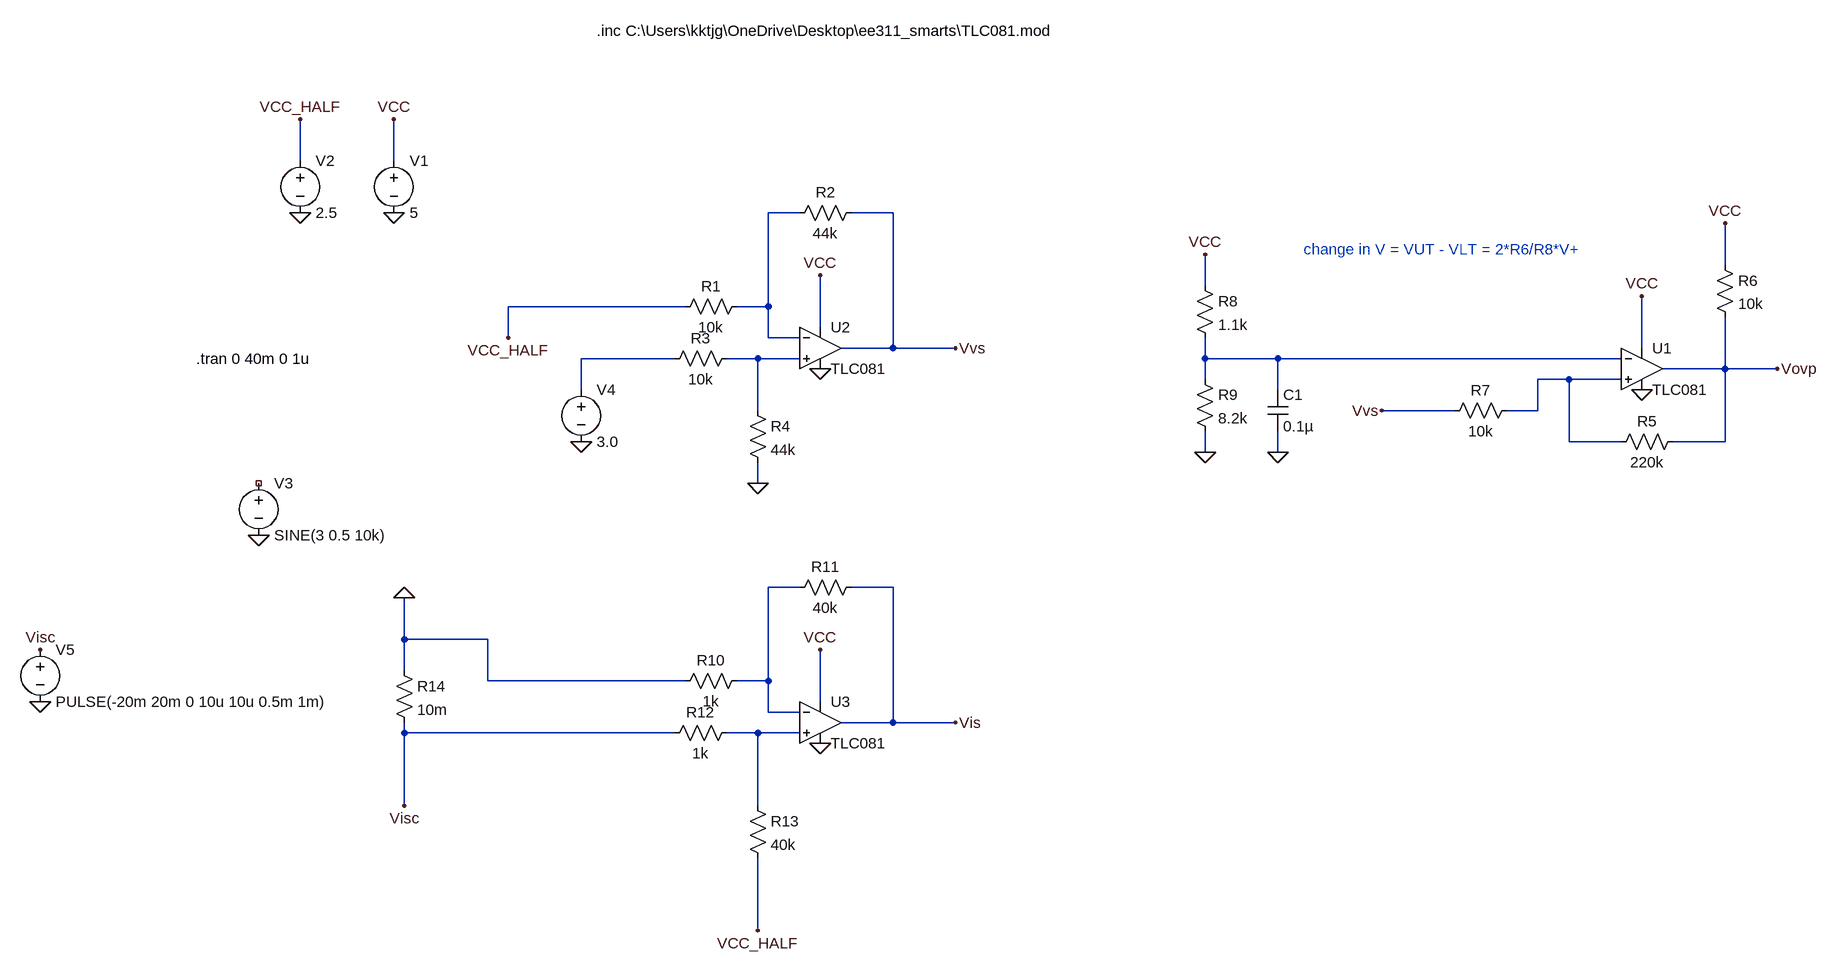
[diagram p0: schematic voltagesensing.asc]
voltagesensing.asc, the LTspice schematic file:
Version 4.1
SHEET 1 4088 1428
WIRE -736 -224 -736 -288
WIRE -592 -224 -592 -288
WIRE 32 -144 -16 -144
WIRE 176 -144 112 -144
WIRE 1456 -64 1456 -128
WIRE 656 -32 656 -80
WIRE -144 0 -416 0
WIRE -16 0 -16 -144
WIRE -16 0 -64 0
WIRE 64 32 64 -48
WIRE -416 48 -416 0
WIRE -16 48 -16 0
WIRE 32 48 -16 48
WIRE 176 64 176 -144
WIRE 176 64 96 64
WIRE 272 64 176 64
WIRE 1328 64 1328 -16
WIRE -160 80 -304 80
WIRE -32 80 -80 80
WIRE 32 80 -32 80
WIRE 656 80 656 48
WIRE 768 80 656 80
WIRE 1296 80 768 80
WIRE 1456 96 1456 16
WIRE 1456 96 1360 96
WIRE 1536 96 1456 96
WIRE 656 112 656 80
WIRE 1216 112 1168 112
WIRE 1296 112 1216 112
WIRE -304 128 -304 80
WIRE 768 128 768 80
WIRE -32 160 -32 80
WIRE 1040 160 928 160
WIRE 1168 160 1168 112
WIRE 1168 160 1120 160
WIRE 1216 208 1216 112
WIRE 1296 208 1216 208
WIRE 1456 208 1456 96
WIRE 1456 208 1376 208
WIRE 656 224 656 192
WIRE 768 224 768 192
WIRE -32 272 -32 240
WIRE 32 432 -16 432
WIRE 176 432 112 432
WIRE -576 512 -576 448
WIRE -448 512 -576 512
WIRE -576 560 -576 512
WIRE -448 576 -448 512
WIRE -144 576 -448 576
WIRE -16 576 -16 432
WIRE -16 576 -64 576
WIRE 64 608 64 528
WIRE -16 624 -16 576
WIRE 32 624 -16 624
WIRE 176 640 176 432
WIRE 176 640 96 640
WIRE 272 640 176 640
WIRE -576 656 -576 640
WIRE -160 656 -576 656
WIRE -32 656 -80 656
WIRE 32 656 -32 656
WIRE -576 768 -576 656
WIRE -32 768 -32 656
WIRE -32 960 -32 848
FLAG -592 -144 0
FLAG 64 -48 VCC
FLAG -736 -144 0
FLAG -592 -288 VCC
FLAG -736 -288 VCC_HALF
FLAG -304 208 0
FLAG -416 48 VCC_HALF
FLAG 64 96 0
FLAG -32 272 0
FLAG 1536 96 Vovp
FLAG 1328 -16 VCC
FLAG 1456 -128 VCC
FLAG 272 64 Vvs
FLAG 928 160 Vvs
FLAG 656 224 0
FLAG 656 -80 VCC
FLAG 768 224 0
FLAG 1328 128 0
FLAG -800 352 0
FLAG 64 528 VCC
FLAG 64 672 0
FLAG 272 640 Vis
FLAG -32 960 VCC_HALF
FLAG -1136 608 0
FLAG -1136 528 Visc
FLAG -576 448 0
FLAG -576 768 Visc
SYMBOL voltage -592 -240 R0
WINDOW 123 0 0 Left 0
WINDOW 39 0 0 Left 0
SYMATTR InstName V1
SYMATTR Value 5
SYMBOL voltage -736 -240 R0
WINDOW 123 0 0 Left 0
WINDOW 39 0 0 Left 0
SYMATTR InstName V2
SYMATTR Value 2.5
SYMBOL res -48 -16 R90
WINDOW 0 0 56 VBottom 2
WINDOW 3 32 56 VTop 2
SYMATTR InstName R1
SYMATTR Value 10k
SYMBOL res 128 -160 R90
WINDOW 0 0 56 VBottom 2
WINDOW 3 32 56 VTop 2
SYMATTR InstName R2
SYMATTR Value 44k
SYMBOL OpAmps\\opamp2 64 0 R0
SYMATTR InstName U2
SYMATTR Value TLC081
SYMBOL res -64 64 R90
WINDOW 0 0 56 VBottom 2
WINDOW 3 32 56 VTop 2
SYMATTR InstName R3
SYMATTR Value 10k
SYMBOL res -48 144 R0
SYMATTR InstName R4
SYMATTR Value 44k
SYMBOL res 1392 192 R90
WINDOW 0 0 56 VBottom 2
WINDOW 3 32 56 VTop 2
SYMATTR InstName R5
SYMATTR Value 220k
SYMBOL res 1440 -80 R0
SYMATTR InstName R6
SYMATTR Value 10k
SYMBOL res 1136 144 R90
WINDOW 0 0 56 VBottom 2
WINDOW 3 32 56 VTop 2
SYMATTR InstName R7
SYMATTR Value 10k
SYMBOL res 640 -48 R0
SYMATTR InstName R8
SYMATTR Value 1.1k
SYMBOL res 640 96 R0
SYMATTR InstName R9
SYMATTR Value 8.2k
SYMBOL cap 752 128 R0
SYMATTR InstName C1
SYMATTR Value 0.1µ
SYMBOL OpAmps\\opamp2 1328 32 R0
SYMATTR InstName U1
SYMATTR Value TLC081
SYMBOL voltage -800 256 R0
WINDOW 123 0 0 Left 0
WINDOW 39 0 0 Left 0
SYMATTR InstName V3
SYMATTR Value SINE(3 0.5 10k)
SYMBOL voltage -304 112 R0
WINDOW 123 0 0 Left 0
WINDOW 39 0 0 Left 0
SYMATTR InstName V4
SYMATTR Value 3.0
SYMBOL res -48 560 R90
WINDOW 0 0 56 VBottom 2
WINDOW 3 32 56 VTop 2
SYMATTR InstName R10
SYMATTR Value 1k
SYMBOL res 128 416 R90
WINDOW 0 0 56 VBottom 2
WINDOW 3 32 56 VTop 2
SYMATTR InstName R11
SYMATTR Value 40k
SYMBOL OpAmps\\opamp2 64 576 R0
SYMATTR InstName U3
SYMATTR Value TLC081
SYMBOL res -64 640 R90
WINDOW 0 0 56 VBottom 2
WINDOW 3 32 56 VTop 2
SYMATTR InstName R12
SYMATTR Value 1k
SYMBOL res -592 544 R0
SYMATTR InstName R14
SYMATTR Value 10m
SYMBOL res -48 752 R0
SYMATTR InstName R13
SYMATTR Value 40k
SYMBOL voltage -1136 512 R0
WINDOW 123 0 0 Left 0
WINDOW 39 0 0 Left 0
SYMATTR InstName V5
SYMATTR Value PULSE(-20m 20m 0 10u 10u 0.5m 1m)
TEXT -896 80 Left 2 !.tran 0 40m 0 1u
TEXT -280 -424 Left 2 !.inc C:\\Users\\kktjg\\OneDrive\\Desktop\\ee311_smarts\\TLC081.mod
TEXT 808 -88 Left 2 ;change in V = VUT - VLT = 2*R6/R8*V+

The netlist it stands for:
* voltagesensing.asc
V1 VCC 0 5
V2 VCC_HALF 0 2.5
R1 N001 VCC_HALF 10k
R2 Vvs N001 44k
X§U2 N003 N001 VCC 0 Vvs TLC081  ; pins In+ In- V+ V- OUT
R3 N003 N002 10k
R4 N003 0 44k
R5 Vovp N005 220k
R6 VCC Vovp 10k
R7 N005 Vvs 10k
R8 VCC N004 1.1k
R9 N004 0 8.2k
C1 N004 0 0.1µ
X§U1 N005 N004 VCC 0 Vovp TLC081  ; pins In+ In- V+ V- OUT
V3 NC_01 0 SINE(3 0.5 10k)
V4 N002 0 3.0
R10 N006 0 1k
R11 Vis N006 40k
X§U3 N007 N006 VCC 0 Vis TLC081  ; pins In+ In- V+ V- OUT
R12 N007 Visc 1k
R14 0 Visc 10m
R13 N007 VCC_HALF 40k
V5 Visc 0 PULSE(-20m 20m 0 10u 10u 0.5m 1m)
.tran 0 40m 0 1u
.inc C:\Users\kktjg\OneDrive\Desktop\ee311_smarts\TLC081.mod
* change in V = VUT - VLT = 2*R6/R8*V+
.backanno
.end